# EAGLE design Arduino Mega (EAGLE 9.5.2)
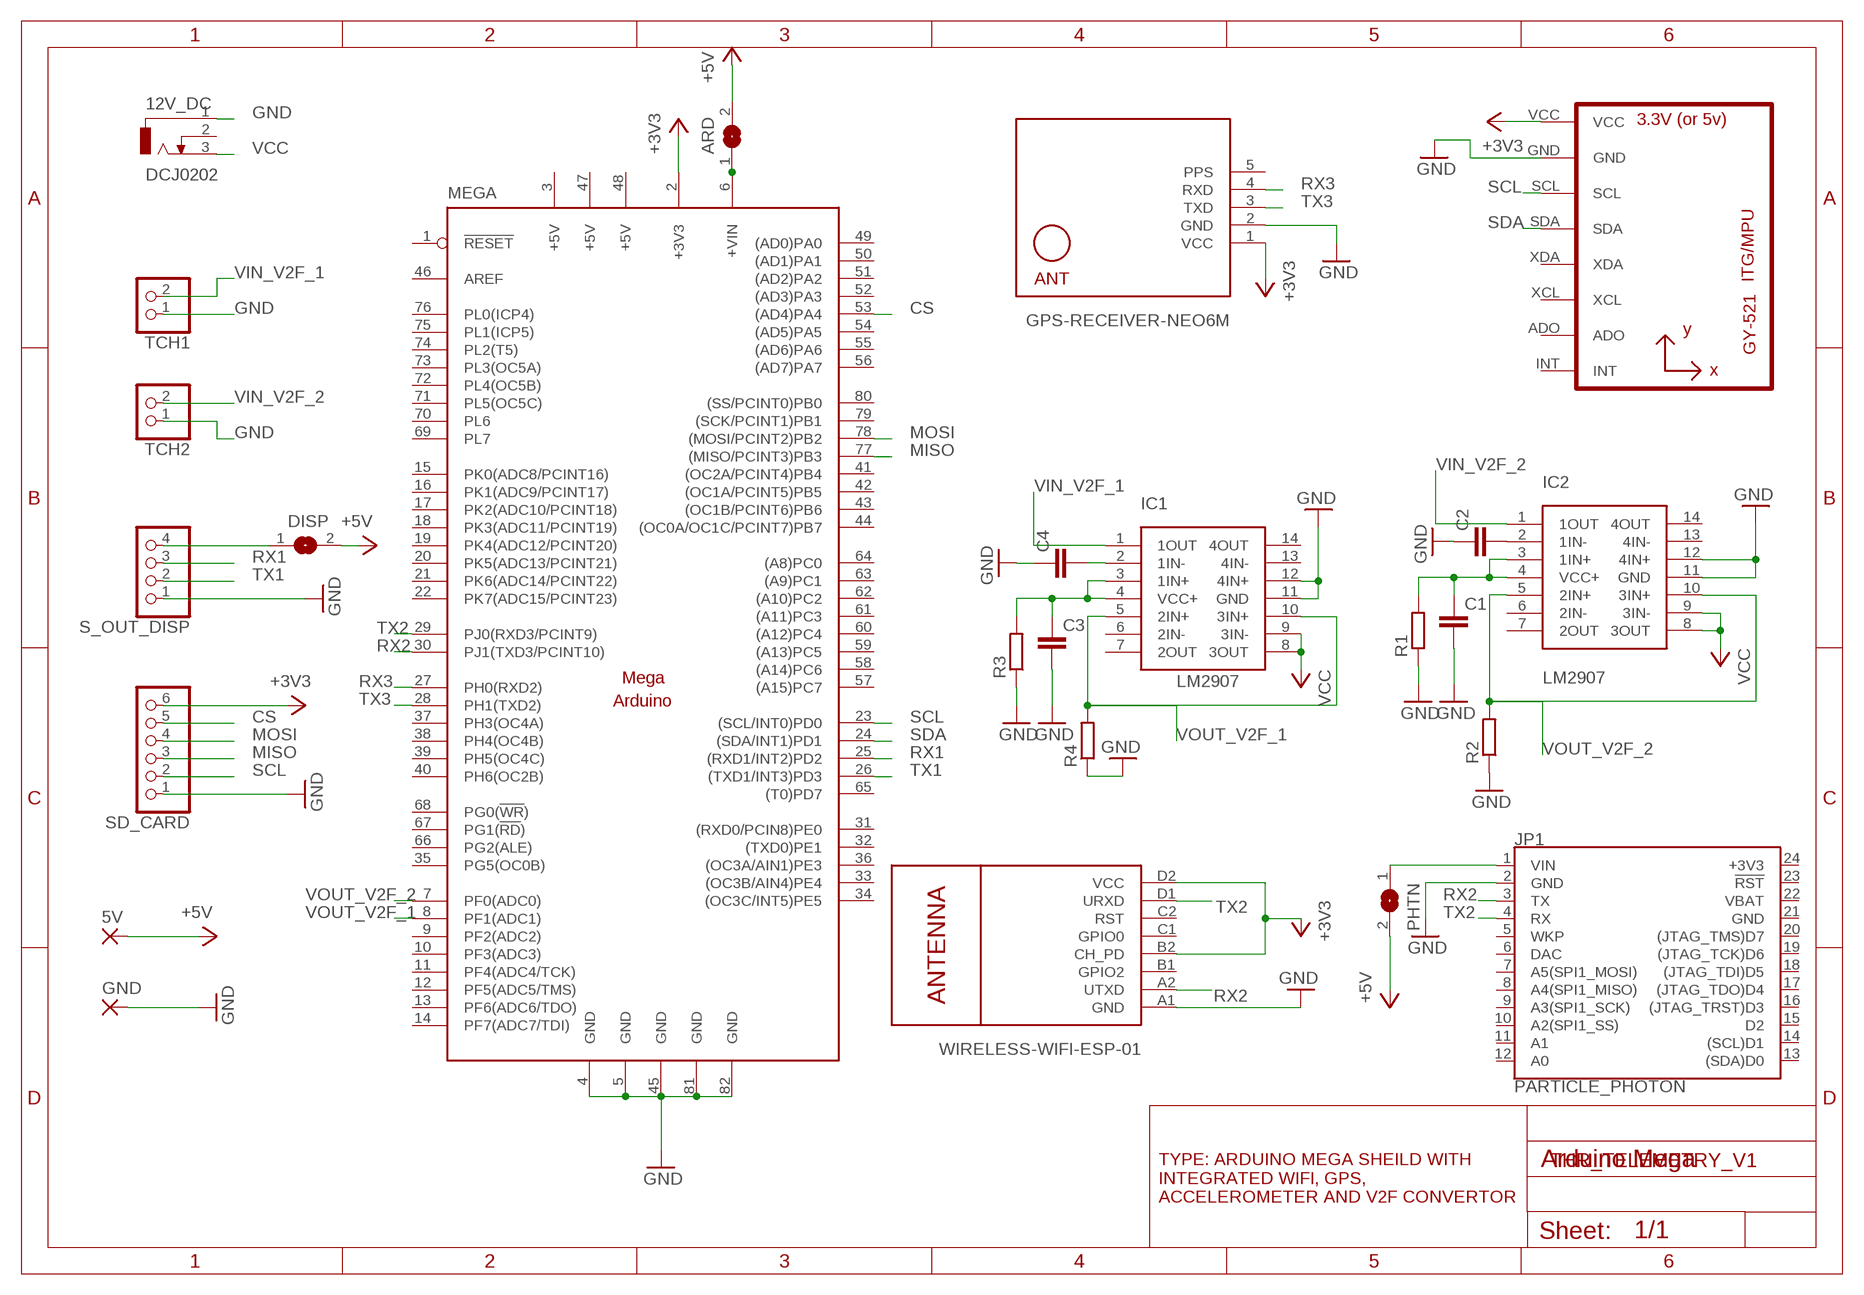
[diagram p0: schematic, sheet 1]

## Parts
5V  WIREPADSMD5-2,5  [5-2,5]
12V_DC  DCJ0202  [DCJ0202]
ARD  SJ  [SJ]
C1  C-EUC0805  [C0805]
C2  C-EUC0805  [C0805]
C3  C-EUC0805  [C0805]
C4  C-EUC0805  [C0805]
DISP  SJ  [SJ]
GND  WIREPADSMD5-2,5  [5-2,5]
IC1  LM2907  LMV324IDR  [14-SOIC]
IC2  LM2907  LMV324IDR  [14-SOIC]
JP1  PARTICLE_PHOTON  [PARTICLE_PHOTON]
MEGA  MEGAARDUINO_11  [MEGA_ARDUINO_1]
PHTN  SJ  [SJ]
R1  R-EU_R0805  [R0805]
R2  R-EU_R0805  [R0805]
R3  R-EU_R0805  [R0805]
R4  R-EU_R0805  [R0805]
S_OUT_DISP  PINHD-1X4  [1X04]
SD_CARD  PINHD-1X6  [1X06]
TCH1  PINHD-1X2  [1X02]
TCH2  PINHD-1X2  [1X02]
U1  GY-521MPU6050  [GY-521]
U$1  GPS-RECEIVER-NEO6M  [GPS-RECEIVER-NEO6M]
U$2  WIRELESS-WIFI-ESP-01  [WIRELESS-WIFI-ESP-01]

## Nets
+3V3: MEGA.2(+3V3) SD_CARD.6 U1.VCC U$1.1(VCC) U$2.B2(CH_PD) U$2.D2(VCC)
+5V: 5V.1(P) ARD.2 DISP.2 PHTN.2
CS: MEGA.53((AD4)PA4) SD_CARD.5
GND: 12V_DC.1 C1.2 C2.1 C3.2 C4.1 GND.1(P) IC1.11(GND) IC1.12(4IN+) IC2.11(GND) IC2.12(4IN+) JP1.2(GND) MEGA.4(GND) MEGA.5(GND) MEGA.45(GND) MEGA.81(GND) MEGA.82(GND) R1.1 R2.1 R3.1 R4.1 S_OUT_DISP.1 SD_CARD.1 TCH1.1 TCH2.1 U1.GND U$1.2(GND) U$2.A1(GND)
MISO: MEGA.77((MISO/PCINT3)PB3) SD_CARD.3
MOSI: MEGA.78((MOSI/PCINT2)PB2) SD_CARD.4
N$1: C2.2 IC2.2(1IN-)
N$2: C1.1 IC2.3(1IN+) IC2.4(VCC+) R1.2
N$3: ARD.1 MEGA.6(+VIN)
N$4: JP1.1(VIN) PHTN.1
N$5: C4.2 IC1.2(1IN-)
N$6: DISP.1 S_OUT_DISP.4
N$7: C3.1 IC1.3(1IN+) IC1.4(VCC+) R3.2
RX1: MEGA.25((RXD1/INT2)PD2) S_OUT_DISP.3
RX2: JP1.3(TX) MEGA.30(PJ1(TXD3/PCINT10)) U$2.A2(UTXD)
RX3: MEGA.27(PH0(RXD2)) U$1.4(RXD)
SCL: MEGA.23((SCL/INT0)PD0) SD_CARD.2 U1.SCL
SDA: MEGA.24((SDA/INT1)PD1) U1.SDA
TX1: MEGA.26((TXD1/INT3)PD3) S_OUT_DISP.2
TX2: JP1.4(RX) MEGA.29(PJ0(RXD3/PCINT9)) U$2.D1(URXD)
TX3: MEGA.28(PH1(TXD2)) U$1.3(TXD)
VCC: 12V_DC.3 IC1.8(3OUT) IC1.9(3IN-) IC2.8(3OUT) IC2.9(3IN-)
VIN_V2F_1: IC1.1(1OUT) TCH1.2
VIN_V2F_2: IC2.1(1OUT) TCH2.2
VOUT_V2F_1: IC1.5(2IN+) IC1.10(3IN+) MEGA.8(PF1(ADC1)) R4.2
VOUT_V2F_2: IC2.5(2IN+) IC2.10(3IN+) MEGA.7(PF0(ADC0)) R2.2
Unconnected: 12V_DC.2 IC1.6(2IN-) IC1.7(2OUT) IC1.13(4IN-) IC1.14(4OUT) IC2.6(2IN-) IC2.7(2OUT) IC2.13(4IN-) IC2.14(4OUT) JP1.5(WKP) JP1.6(DAC) JP1.7(A5(SPI1_MOSI)) JP1.8(A4(SPI1_MISO)) JP1.9(A3(SPI1_SCK)) JP1.10(A2(SPI1_SS)) JP1.11(A1) JP1.12(A0) JP1.13((SDA)D0) JP1.14((SCL)D1) JP1.15(D2) JP1.16((JTAG_TRST)D3) JP1.17((JTAG_TDO)D4) JP1.18((JTAG_TDI)D5) JP1.19((JTAG_TCK)D6) JP1.20((JTAG_TMS)D7) JP1.23(!RST!) MEGA.1(!RESET) MEGA.9(PF2(ADC2)) MEGA.10(PF3(ADC3)) MEGA.11(PF4(ADC4/TCK)) MEGA.12(PF5(ADC5/TMS)) MEGA.13(PF6(ADC6/TDO)) MEGA.14(PF7(ADC7/TDI)) MEGA.15(PK0(ADC8/PCINT16)) MEGA.16(PK1(ADC9/PCINT17)) MEGA.17(PK2(ADC10/PCINT18)) MEGA.18(PK3(ADC11/PCINT19)) MEGA.19(PK4(ADC12/PCINT20)) MEGA.20(PK5(ADC13/PCINT21)) MEGA.21(PK6(ADC14/PCINT22)) MEGA.22(PK7(ADC15/PCINT23)) MEGA.31((RXD0/PCIN8)PE0) MEGA.32((TXD0)PE1) MEGA.33((OC3B/AIN4)PE4) MEGA.34((OC3C/INT5)PE5) MEGA.35(PG5(OC0B)) MEGA.36((OC3A/AIN1)PE3) MEGA.37(PH3(OC4A)) MEGA.38(PH4(OC4B)) MEGA.39(PH5(OC4C)) MEGA.40(PH6(OC2B)) MEGA.41((OC2A/PCINT4)PB4) MEGA.42((OC1A/PCINT5)PB5) MEGA.43((OC1B/PCINT6)PB6) MEGA.44((OC0A/OC1C/PCINT7)PB7) MEGA.46(AREF) MEGA.49((AD0)PA0) MEGA.50((AD1)PA1) MEGA.51((AD2)PA2) MEGA.52((AD3)PA3) MEGA.54((AD5)PA5) MEGA.55((AD6)PA6) MEGA.56((AD7)PA7) MEGA.57((A15)PC7) MEGA.58((A14)PC6) MEGA.59((A13)PC5) MEGA.60((A12)PC4) MEGA.61((A11)PC3) MEGA.62((A10)PC2) MEGA.63((A9)PC1) MEGA.64((A8)PC0) MEGA.65((T0)PD7) MEGA.66(PG2(ALE)) MEGA.67(PG1(!RD!)) MEGA.68(PG0(!WR!)) MEGA.69(PL7) MEGA.70(PL6) MEGA.71(PL5(OC5C)) MEGA.72(PL4(OC5B)) MEGA.73(PL3(OC5A)) MEGA.74(PL2(T5)) MEGA.75(PL1(ICP5)) MEGA.76(PL0(ICP4)) MEGA.79((SCK/PCINT1)PB1) MEGA.80((SS/PCINT0)PB0) U1.ADO U1.INT U1.XCL U1.XDA U$2.B1(GPIO2) U$2.C1(GPIO0) U$2.C2(RST)

## Notes on the sheet
- THR_TELEMETRY_V1
- TYPE: ARDUINO MEGA SHEILD WITH
  INTEGRATED WIFI, GPS, 
  ACCELEROMETER AND V2F CONVERTOR

## Power pins joined to a net without a drawn wire
+3V3: JP1.24(+3V3)
+5V: MEGA.3(+5V) MEGA.47(+5V) MEGA.48(+5V)
GND: JP1.21(GND)
PPS: U$1.5(PPS)
VBAT: JP1.22(VBAT)

## Library data of the parts
5V GND = wirepad:WIREPAD: Wire PAD connect wire on PCB
12V_DC = con-jack:DCJ0202: DC POWER JACK Source: DCJ0202.pdf; OC_FARNELL: unknown; OC_NEWARK: unknown
ARD DISP PHTN = jumper:SJ: SMD solder JUMPER
C1-C4 = rcl:C-EU: CAPACITOR, European symbol; SPICEPREFIX: C
IC1 IC2 = IC:LMV324IDR: IC OPAMP GP 4 CIRCUIT 14SOIC Manufacturer's datasheet <http://www.ti.com/lit/ds/symlink/lmv324.pdf>; CREATED_BY: PCBLayout.com; DIGIKEY_PART_NUMBER: 296-9569-1-ND; MANUFACTURER: Texas Instruments; MPN: LMV324IDR; PACKAGE: 14-SOIC
JP1 = SparkFun-Boards:PARTICLE_PHOTON: Particle Photon Footprint of the Particle Photon that is used as a basis for many Photon shields. SparkFun Products: Particle Photon <https://www.sparkfun.com/products/13764> SparkFun Photon ProtoShield <https://www.sparkfun.com/products/13598> SparkFun Photon micro OLED Shield <https://www.sparkfun.com/products/13628> SparkFun Photon IMU Shield <https://www.sparkfun.com/products/13629> SparkFun Photon Battery Shield <https://www.sparkfun.com/products/13626>
MEGA = arduino_mega shield:MEGAARDUINO_1: The Arduino Mega is a microcontroller board based on the ATmega1280. - 54 digital input/output pins (of which 14 can be used as PWM outputs) - 16 analog inputs - 4 UARTs (hardware serial ports) - 16 MHz crystal oscillator - USB connection - power jack - ICSP header - reset button It contains everything needed to support the microcontroller; simply connect it to a computer with a USB cable or power it with a AC-to-DC adapter or battery to get started. The Mega is compatible with most shields designed for the Arduino Duemilanove or Diecimila. http://arduino.cc/en/Main/ArduinoBoardMega
R1-R4 = rcl:R-EU_: RESISTOR, European symbol; SPICEPREFIX: R
S_OUT_DISP = pinhead:PINHD-1X4: PIN HEADER
SD_CARD = pinhead:PINHD-1X6: PIN HEADER
TCH1 TCH2 = pinhead:PINHD-1X2: PIN HEADER
U1 = mpu 6050:GY-521
U$1 = neo 6m:GPS-RECEIVER-NEO6M: GPS Receiver Module based on NEO-6 device Short tutorial how to use NEO-6 module with Arduino: http://www.xarg.org/2016/06/neo6mv2-gps-module-with-arduino/ NEO-6 datasheet is available here: https://www.u-blox.com/sites/default/files/products/documents/NEO-6_DataSheet_%28GPS.G6-HW-09005%29.pdf Click here to find device on ebay.com <http://www.ebay.com/sch/gyneo6mv2>
U$2 = diy-modules:WIRELESS-WIFI-ESP-01: Wireless Wi-Fi ESP-01 Module based on ESP8266 chip Click here to find device on ebay.com <http://www.ebay.com/sch/esp8266+esp+01+transceiver>

## Board
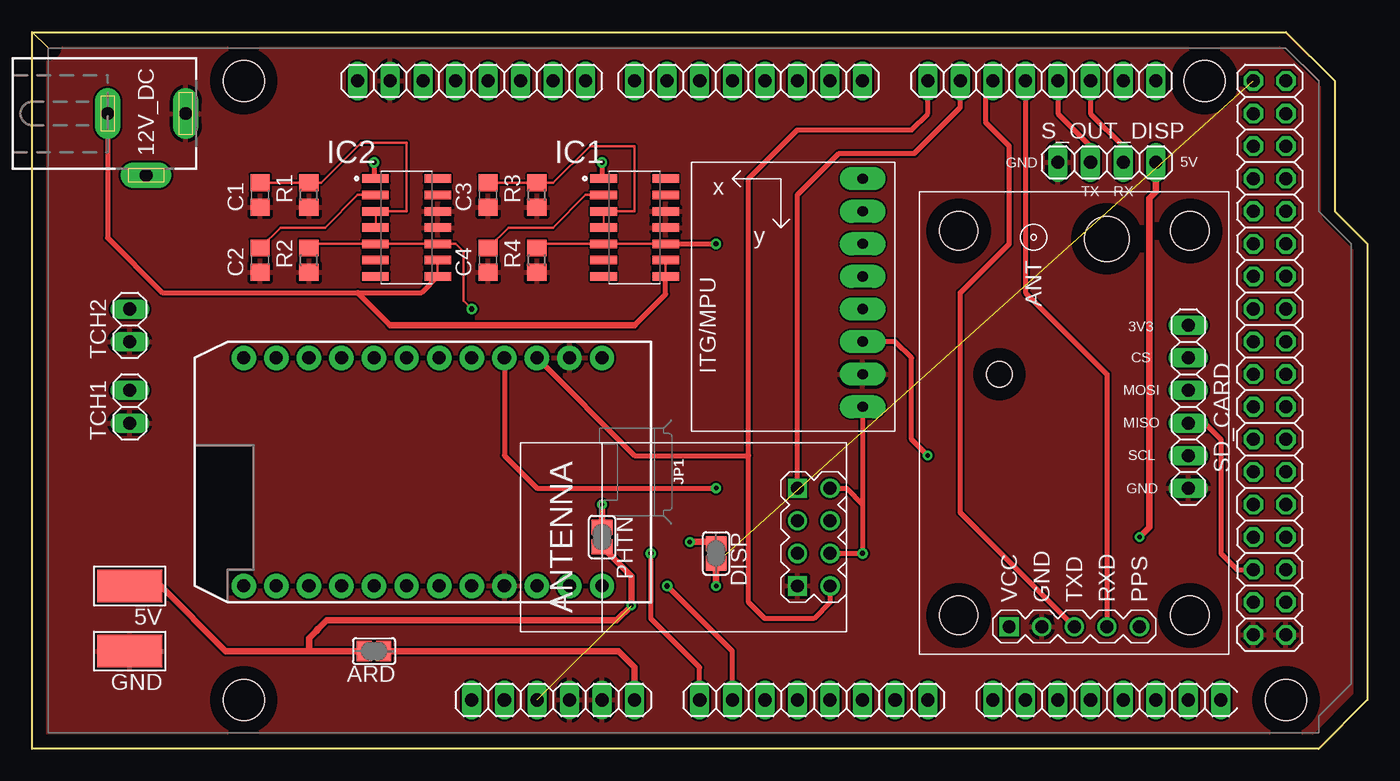
[diagram p1: board, top side]
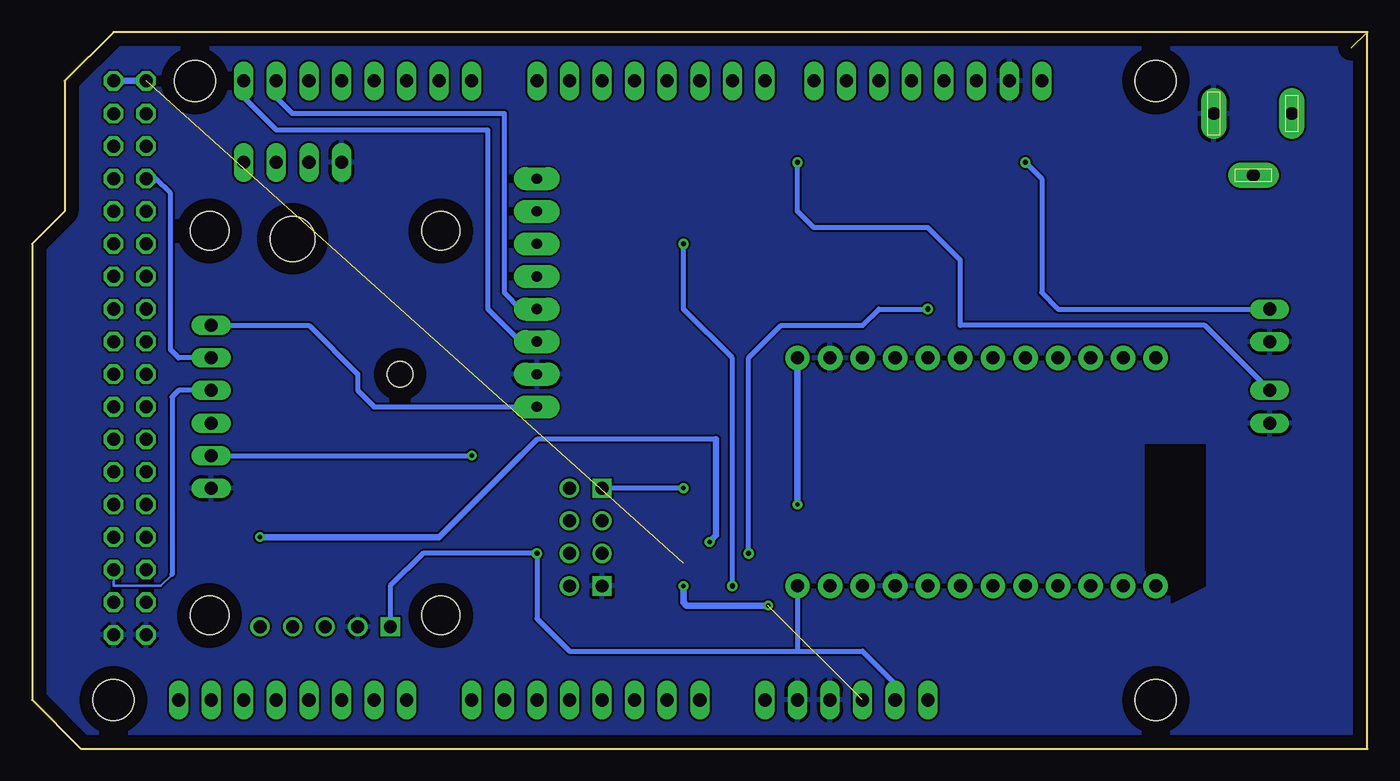
[diagram p2: board, bottom side, seen from below]

Size 104.14 x 55.88 mm. Coordinates in mm from the lower left corner, seen from the top.
Outline: 1.27,54.66 0,55.88
Outline: 0,55.88 0,0 100.33,0 104.14,3.81 104.14,39.37 101.6,41.91 101.6,52.07 97.79,55.88 0,55.88
Copper layers (1*16): Top 0.035mm / dielectric 1.5mm / Bottom 0.035mm
Design rules "default": minimum track width 6mil, minimum drill 0.35mm, track to track 6mil, track to pad 6mil, pad to pad 6mil, via to via 6mil, smd to smd 6mil, copper to edge 40mil, drill to drill 6mil, minimum pad ring 10mil, minimum via ring 8mil, stop-mask expansion 4mil, vias tented up to drill 0mil, thermal gap 10mil

### Footprints (pad centres in the part's own frame; a part is rotated, then mirrored left to right if it is on the bottom)
5-2,5 = smd 2.54 x 5.08: 1 0,0
DCJ0202 = drill 1 pad 2 long: 1 0,3.1; 2 4.8,0; 3 0,-3
SJ = smd 1.168 x 1.6: 1 -0.762,0; 2 0.762,0
C0805 = smd 1.3 x 1.5: 1 -0.95,0; 2 0.95,0
14-SOIC = smd 2.07 x 0.66: 1 -2.425,3.81; 2 -2.425,2.54; 3 -2.425,1.27; 4 -2.425,0; 5 -2.425,-1.27; 6 -2.425,-2.54; 7 -2.425,-3.81; 8 2.425,-3.81; 9 2.425,-2.54; 10 2.425,-1.27; 11 2.425,0; 12 2.425,1.27; 13 2.425,2.54; 14 2.425,3.81
PARTICLE_PHOTON = drill 1.016 pad 1.905: 1 -8.89,13.97; 2 -8.89,11.43; 3 -8.89,8.89; 4 -8.89,6.35; 5 -8.89,3.81; 6 -8.89,1.27; 7 -8.89,-1.27; 8 -8.89,-3.81; 9 -8.89,-6.35; 10 -8.89,-8.89; 11 -8.89,-11.43; 12 -8.89,-13.97; 13 8.89,-13.97; 14 8.89,-11.43; 15 8.89,-8.89; 16 8.89,-6.35; 17 8.89,-3.81; 18 8.89,-1.27; 19 8.89,1.27; 20 8.89,3.81; 21 8.89,6.35; 22 8.89,8.89; 23 8.89,11.43; 24 8.89,13.97
MEGA_ARDUINO_1 = drill 1.016 long: 1 33.02,2.54; 2 35.56,2.54; 3 38.1,2.54; 4 40.64,2.54; 5 43.18,2.54; 6 45.72,2.54; 7 50.8,2.54; 8 53.34,2.54; 9 55.88,2.54; 10 58.42,2.54; 11 60.96,2.54; 12 63.5,2.54; 13 66.04,2.54; 14 68.58,2.54; 15 73.66,2.54; 16 76.2,2.54; 17 78.74,2.54; 18 81.28,2.54; 19 83.82,2.54; 20 86.36,2.54; 21 88.9,2.54; 22 91.44,2.54; 23 86.36,50.8; 24 83.82,50.8; 25 81.28,50.8; 26 78.74,50.8; 27 76.2,50.8; 28 73.66,50.8; 29 71.12,50.8; 30 68.58,50.8; 31 63.5,50.8; 32 60.96,50.8; 33 58.42,50.8; 34 55.88,50.8; 35 53.34,50.8; 36 50.8,50.8; 37 48.26,50.8; 38 45.72,50.8; 39 41.91,50.8; 40 39.37,50.8; 41 36.83,50.8; 42 34.29,50.8; 43 31.75,50.8; 44 29.21,50.8; 45 26.67,50.8; 46 24.13,50.8 | drill 1.016 octagon: 47 93.98,50.8; 48 96.52,50.8; 49 93.98,48.26; 50 96.52,48.26; 51 93.98,45.72; 52 96.52,45.72; 53 93.98,43.18; 54 96.52,43.18; 55 93.98,40.64; 56 96.52,40.64; 57 93.98,38.1; 58 96.52,38.1; 59 93.98,35.56; 60 96.52,35.56; 61 93.98,33.02; 62 96.52,33.02; 63 93.98,30.48; 64 96.52,30.48; 65 93.98,27.94; 66 96.52,27.94; 67 93.98,25.4; 68 96.52,25.4; 69 93.98,22.86; 70 96.52,22.86; 71 93.98,20.32; 72 96.52,20.32; 73 93.98,17.78; 74 96.52,17.78; 75 93.98,15.24; 76 96.52,15.24; 77 93.98,12.7; 78 96.52,12.7; 79 93.98,10.16; 80 96.52,10.16; 81 93.98,7.62; 82 96.52,7.62 | hole 3.2: 15.24,50.8; 15.24,2.54; 90.17,50.8; 96.52,2.54 | hole 2: 74.168,27.94
R0805 = smd 1.3 x 1.5: 1 -0.95,0; 2 0.95,0
1X04 = drill 1.016 long: 1 -3.81,0; 2 -1.27,0; 3 1.27,0; 4 3.81,0
1X06 = drill 1.016 long: 1 -6.35,0; 2 -3.81,0; 3 -1.27,0; 4 1.27,0; 5 3.81,0; 6 6.35,0
1X02 = drill 1.016 long: 1 -1.27,0; 2 1.27,0
GY-521 = drill 0.8 pad 1.778 long: ADO -8.89,-6.35; GND -8.89,6.35; INT -8.89,-8.89; SCL -8.89,3.81; SDA -8.89,1.27; VCC -8.89,8.89; XCL -8.89,-3.81; XDA -8.89,-1.27
GPS-RECEIVER-NEO6M = drill 1 square: 1 -15.875,5.08 | drill 1: 2 -15.875,2.54; 3 -15.875,0; 4 -15.875,-2.54; 5 -15.875,-5.08 | hole 3: -14.986,9.017; -14.986,-9.017; 14.986,-9.017; 14.986,9.017 | hole 3.5: 14.351,-2.54
WIRELESS-WIFI-ESP-01 = drill 1 square: A1 -8.89,3.81; D1 -8.89,-3.81 | drill 1: A2 -11.43,3.81; B1 -8.89,1.27; B2 -11.43,1.27; C1 -8.89,-1.27; C2 -11.43,-1.27; D2 -11.43,-3.81

### Placement (x,y rotation side)
5V  7.62,12.7 90 top
12V_DC  8.89,49.53 270 top
ARD  26.67,7.62 180 top
C1  17.78,43.18 270 top
C2  17.78,38.1 90 top
C3  35.56,43.18 270 top
C4  35.56,38.1 90 top
DISP  53.34,15.24 270 top
GND  7.62,7.62 90 top
IC1  46.99,40.64 0 top
IC2  29.21,40.64 0 top
JP1  30.48,21.59 270 top
MEGA  1.27,1.27 0 top
PHTN  44.45,16.51 270 top
R1  21.59,43.18 90 top
R2  21.59,38.1 90 top
R3  39.37,43.18 90 top
R4  39.37,38.1 90 top
S_OUT_DISP  83.82,45.72 0 top
SD_CARD  90.17,26.67 90 top
TCH1  7.62,26.67 90 top
TCH2  7.62,33.02 90 top
U1  55.88,35.56 180 top
U$1  81.28,25.4 90 top
U$2  50.8,16.51 180 top

### Tracks (layer width: path | path; a pad name or v marks a point on that pad's centre or on a via)
+3V3  (via drill 0.4)
  Top 0.406: U$2.B2 v64.77,15.24 | U$2.D2 63.5,20.32 64.77,19.05 v64.77,15.24 | U1.VCC v64.77,15.24
  Bottom 0.406: 44.45,7.62 62.23,7.62 64.77,10.16 v64.77,15.24 73.66,15.24 76.2,12.7 U$1.1 | 44.45,7.62 39.37,7.62 36.83,5.08 MEGA.2 | JP1.24 44.45,7.62 | SD_CARD.6 82.55,33.02 78.74,29.21 78.74,27.94 77.47,26.67 U1.VCC
+5V  (via drill 0.35)  (2 unrouted)
  Top 0.508: 21.59,7.62 ARD.2 23.37,7.62 | 21.59,7.62 15.11,7.62 10.03,12.7 5V.1 | PHTN.2 46.74,13.46 v46.74,11.18 45.59,10.03 22.99,10.03 22.35,9.4 22.1,9.14 21.59,8.64 21.59,7.62 | v53.34,12.7 DISP.2
  Bottom 0.508: MEGA.47 MEGA.48 | v46.74,11.18 53.09,11.18 53.34,11.43 v53.34,12.7
CS
  Bottom 0.406: SD_CARD.5 92.71,30.48 93.34,31.12 93.34,43.31 94.49,44.45 MEGA.53
GND
  pour Top: 0,-1.27 0,57.15 105.41,57.15 105.41,-1.27
  pour Bottom: 0,57.15 0,-1.27 105.41,-1.27 105.41,57.15
MISO
  Top 0.406: SD_CARD.3 91.44,25.4 92.71,24.13 92.71,15.24 93.98,13.97 MEGA.77
MOSI
  Bottom 0.2: 93.22,13.59 94.11,12.7 97.79,12.7 MEGA.78
  Bottom 0.406: SD_CARD.4 92.71,27.94 93.22,27.43 93.22,13.59
N$1
  Top 0.2: C2.2 19.37,40.64 22.86,40.64 25.4,43.18 IC2.2
N$2
  Top 0.152: IC2.3 IC2.4
  Top 0.2: IC2.3 29.21,41.91 29.21,47.27 25.68,47.27 22.54,44.13 R1.2 C1.1
N$3
  Top 0.508: ARD.1 45.72,7.62 46.99,6.35 MEGA.6
N$4  (via drill 0.35)
  Top 0.508: v44.45,19.05 PHTN.1
  Bottom 0.508: JP1.1 v44.45,19.05
N$5
  Top 0.152: 44.45,43.18 IC1.2
  Top 0.2: C4.2 37.15,40.64 40.64,40.64 43.18,43.18 44.45,43.18
N$6  (via drill 0.35)
  Top 0.508: S_OUT_DISP.4 87.63,43.43 87.12,42.93 87.12,17.27 v86.36,16.51 | v51.31,16.13 53.21,16.13 DISP.1
  Bottom 0.406: 50.8,24.13 64.77,24.13 66.04,22.86
  Bottom 0.508: v86.36,16.51 72.39,16.51 66.04,22.86 | v51.31,16.13 50.8,16.64 50.8,24.13
N$7
  Top 0.152: IC1.3 IC1.4
  Top 0.2: IC1.3 46.99,41.91 46.99,46.99 43.5,46.99 40.64,44.13 R3.2 C3.1
RX1
  Top 0.406: MEGA.25 82.55,49.53 85.09,46.99 S_OUT_DISP.3
RX2
  Top 0.406: U$2.A2 62.23,11.43 60.96,10.16 57.15,10.16 55.88,11.43 55.88,22.86 | 55.88,22.86 55.88,44.45 59.69,48.26 68.58,48.26 69.85,49.53 MEGA.30 | JP1.3 46.99,22.86 55.88,22.86
RX3
  Top 0.406: MEGA.27 77.47,35.56 83.82,29.21 U$1.4
SCL  (via drill 0.35)
  Top 0.406: v69.85,22.86 68.58,24.13 68.58,30.48 67.31,31.75 U1.SCL
  Bottom 0.406: U1.SCL 66.04,31.75 68.58,34.29 68.58,48.26 85.09,48.26 87.63,50.8 MEGA.23 | SD_CARD.2 v69.85,22.86
SDA
  Bottom 0.406: U1.SDA 66.04,34.29 67.31,35.56 67.31,49.53 83.82,49.53 85.09,50.8 MEGA.24
TX1
  Top 0.406: MEGA.26 80.01,49.53 82.55,46.99 S_OUT_DISP.2
TX2  (via drill 0.35)
  Top 0.406: MEGA.29 72.39,50.01 68.81,46.43 62.94,46.43 59.69,43.18 U$2.D1 | JP1.4 36.83,22.86 39.37,20.32 v53.34,20.32
  Bottom 0.406: v53.34,20.32 U$2.D1
TX3
  Top 0.406: U$1.3 72.39,18.41 72.39,35.56 76.2,39.37 76.2,46.99 74.37,48.82 74.37,51.03 74.93,51.59 MEGA.28
VCC
  Top 0.2: IC1.8 IC1.9 | IC2.9 IC2.8
  Top 0.406: 12V_DC.3 5.89,39.83 10.16,35.56 25.4,35.56 | 46.99,33.02 49.41,35.45 IC1.8 | 25.4,35.56 30.37,35.56 IC2.8 | 27.94,33.02 25.4,35.56
  Top 0.508: 46.99,33.02 27.94,33.02
VIN_V2F_1  (via drill 0.4)
  Top 0.406: v44.45,45.72 44.45,44.56 IC1.1
  Bottom 0.406: TCH1.2 12.7,33.02 31.75,33.02 31.75,38.1 34.29,40.64 43.18,40.64 44.45,41.91 v44.45,45.72
VIN_V2F_2  (via drill 0.4)
  Top 0.406: v26.67,45.72 26.67,44.45 IC2.1
  Bottom 0.406: TCH2.2 24.13,34.29 25.4,35.56 25.4,44.45 v26.67,45.72
VOUT_V2F_1  (via drill 0.4)
  Top 0.2: R4.2 39.69,39.37 IC1.5 IC1.10
  Top 0.406: MEGA.8 54.61,7.62 v49.53,12.7 | IC1.10 v53.34,39.37
  Bottom 0.406: v49.53,12.7 49.53,30.48 53.34,34.29 v53.34,39.37
VOUT_V2F_2  (via drill 0.4)
  Top 0.2: R2.2 21.91,39.37 IC2.5 IC2.10 33.02,39.37 33.65,38.73 33.65,34.92 v34.29,34.29
  Top 0.406: MEGA.7 52.07,6.35 48.26,10.16 v48.26,15.24
  Bottom 0.406: v48.26,15.24 48.26,30.48 45.72,33.02 39.37,33.02 38.1,34.29 v34.29,34.29

### Text on the board
tNames: 5V | GND | TX | RX | 3V3 | CS | MOSI | MISO | SCL | GND
112bmp: C:/Users/saika/Downloads/download.bmp